# EAGLE design HS(MASTER)V3 (EAGLE 8.3.0)
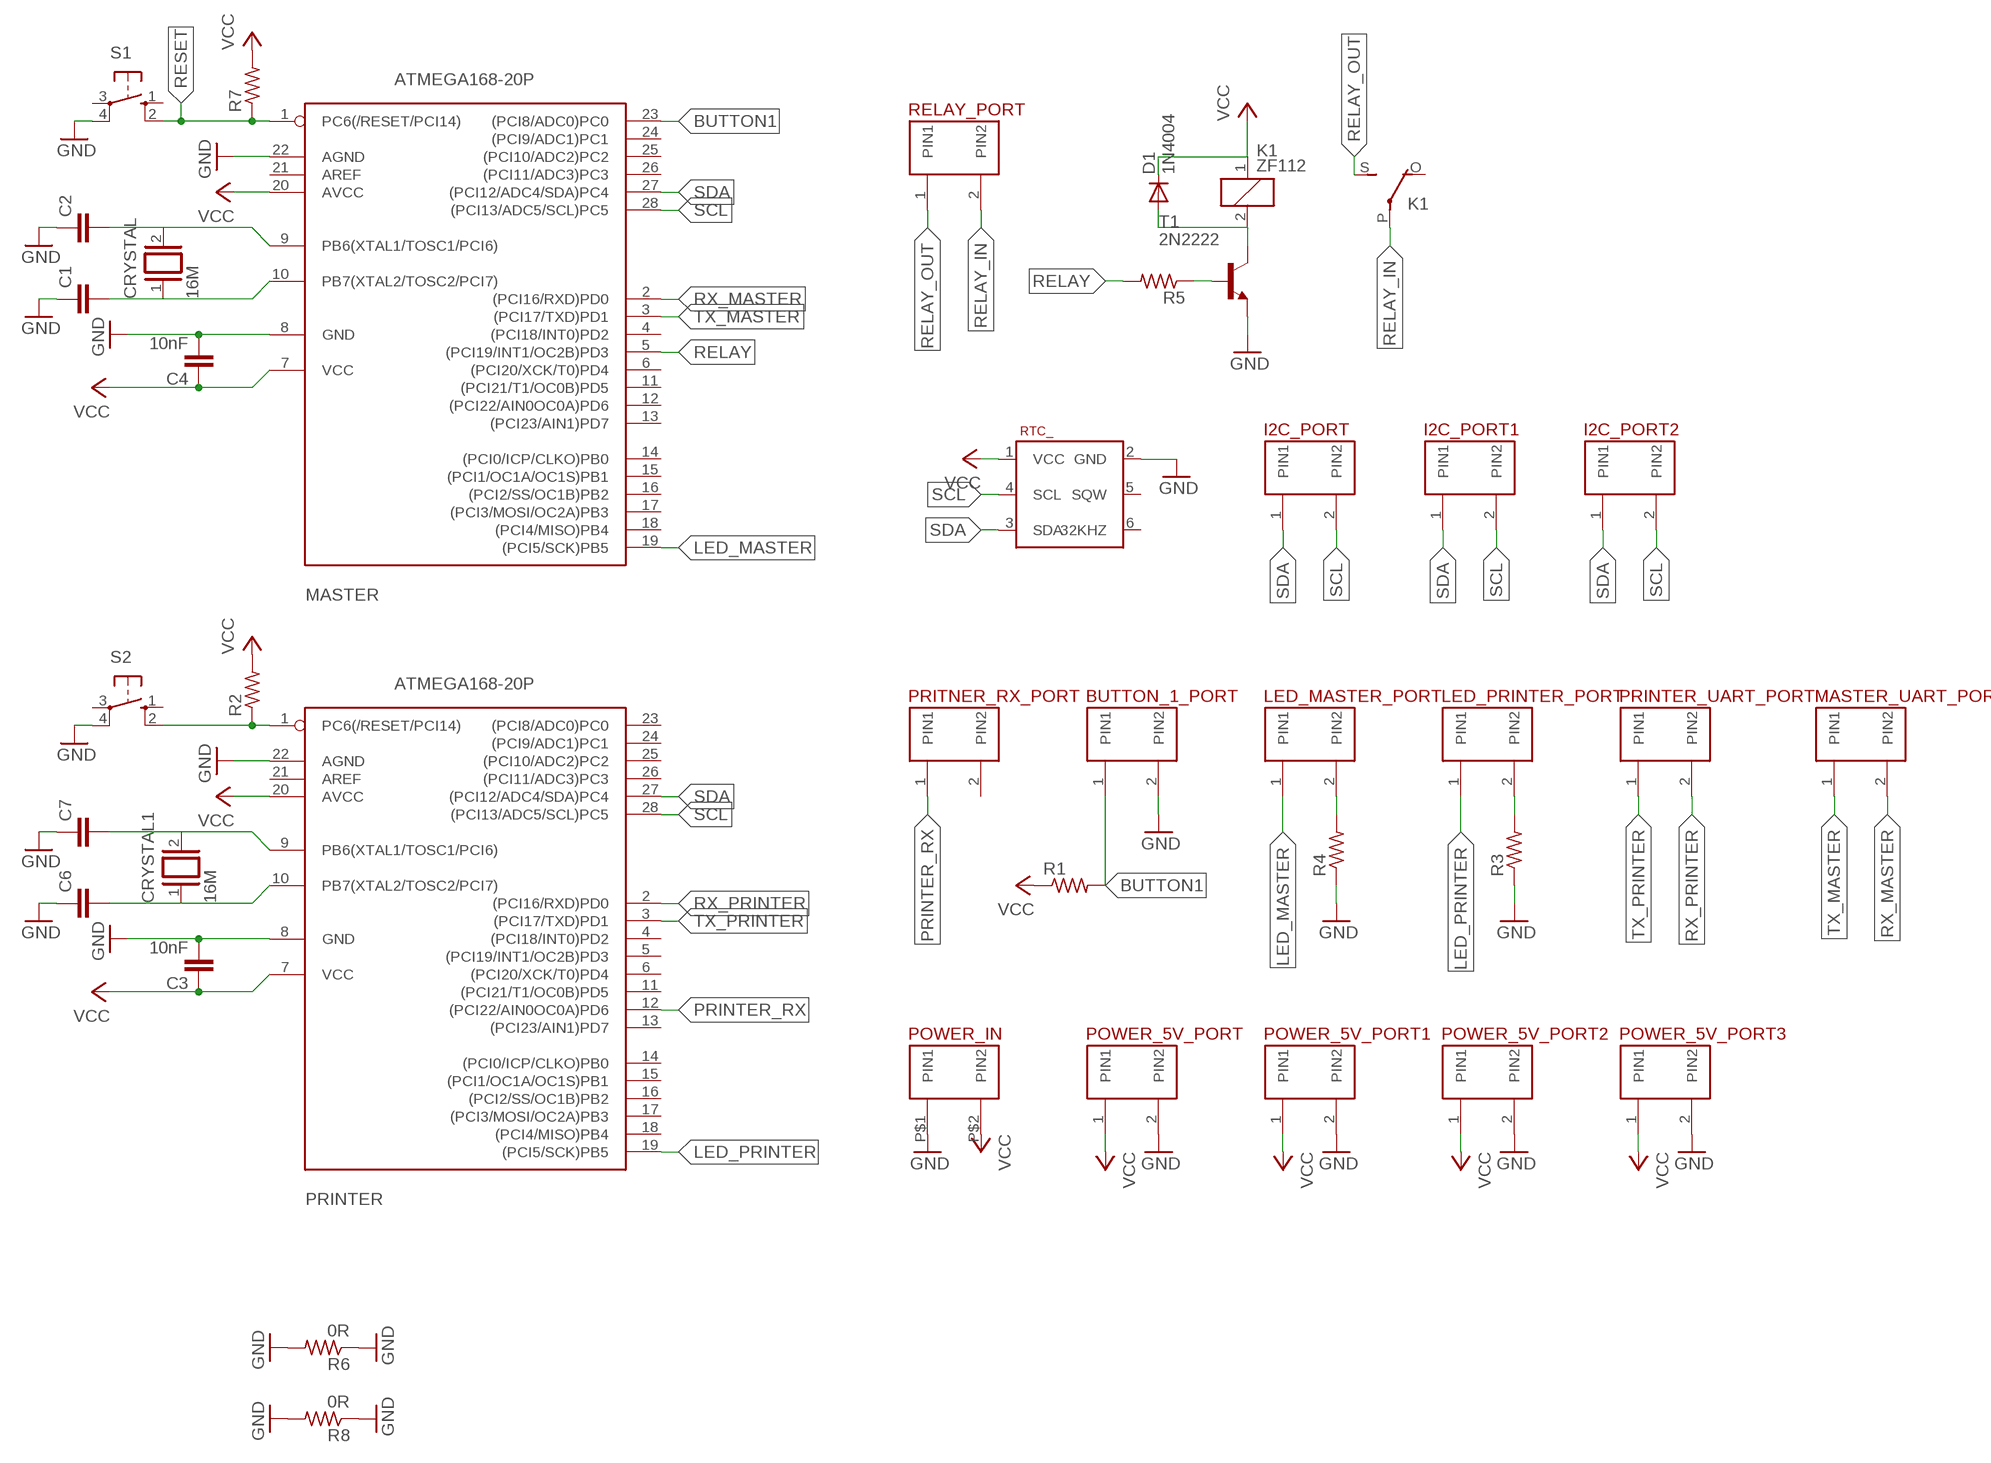
[diagram p0: schematic, sheet 1]

## Parts
BUTTON_1_PORT  7325  [2.54MM]
C1  C-EU025-024X044  [C025-024X044]
C2  C-EU025-024X044  [C025-024X044]
C3  10nF  C5/2.5  [C5B2.5]
C4  10nF  C5/2.5  [C5B2.5]
C6  C-EU025-024X044  [C025-024X044]
C7  C-EU025-024X044  [C025-024X044]
CRYSTAL  16M  XTAL/S  [QS]
CRYSTAL1  16M  XTAL/S  [QS]
D1  1N4004  [DO41-10]
I2C_PORT  7325  [2.54MM]
I2C_PORT1  7325  [2.54MM]
I2C_PORT2  7325  [2.54MM]
K1  ZF112  [ZF112]
LED_MASTER_PORT  7325  [2.54MM]
LED_PRINTER_PORT  7325  [2.54MM]
MASTER  ATMEGA168-20P  [DIL28-3]
MASTER_UART_PORT  7325  [2.54MM]
POWER_5V_PORT  7325  [2.54MM]
POWER_5V_PORT1  7325  [2.54MM]
POWER_5V_PORT2  7325  [2.54MM]
POWER_5V_PORT3  7325  [2.54MM]
POWER_IN  4396  [4MM]
PRINTER  ATMEGA168-20P  [DIL28-3]
PRINTER_UART_PORT  7325  [2.54MM]
PRITNER_RX_PORT  7325  [2.54MM]
R1  R-US_0207/10  [0207/10]
R2  R-US_0207/10  [0207/10]
R3  R-US_0207/10  [0207/10]
R4  R-US_0207/10  [0207/10]
R5  R-US_0207/10  [0207/10]
R6  0R  R-US_0207/10  [0207/10]
R7  R-US_0207/10  [0207/10]
R8  0R  R-US_0207/10  [0207/10]
RELAY_PORT  7325  [2.54MM]
RTC_  RTC_DS3231_6_PIN  [RTC_DS3231_6_PIN]
S1  10-XX  [B3F-10XX]
S2  10-XX  [B3F-10XX]
T1  2N2222  [TO92-EBC-OVAL]

## Nets
BUTTON1: BUTTON_1_PORT.1(PIN1) MASTER.23((PCI8/ADC0)PC0) R1.2
GND: BUTTON_1_PORT.2(PIN2) C1.1 C2.1 C3.2 C4.2 C6.1 C7.1 MASTER.8(GND) MASTER.22(AGND) POWER_5V_PORT1.2(PIN2) POWER_5V_PORT2.2(PIN2) POWER_5V_PORT3.2(PIN2) POWER_5V_PORT.2(PIN2) POWER_IN.P$1(PIN1) PRINTER.8(GND) PRINTER.22(AGND) R3.1 R4.1 R6.1 R6.2 R8.1 R8.2 RTC_.2(GND) S1.4(P1) S2.4(P1) T1.E
LED_MASTER: LED_MASTER_PORT.1(PIN1) MASTER.19((PCI5/SCK)PB5)
LED_PRINTER: LED_PRINTER_PORT.1(PIN1) PRINTER.19((PCI5/SCK)PB5)
N$1: C2.2 CRYSTAL.2 MASTER.9(PB6(XTAL1/TOSC1/PCI6))
N$2: C1.2 CRYSTAL.1 MASTER.10(PB7(XTAL2/TOSC2/PCI7))
N$3: D1.A K1.2 T1.C
N$5: LED_MASTER_PORT.2(PIN2) R4.2
N$6: C7.2 CRYSTAL1.2 PRINTER.9(PB6(XTAL1/TOSC1/PCI6))
N$7: C6.2 CRYSTAL1.1 PRINTER.10(PB7(XTAL2/TOSC2/PCI7))
N$8: PRINTER.1(PC6(/RESET/PCI14)) R2.1 S2.2(S1)
N$9: LED_PRINTER_PORT.2(PIN2) R3.2
N$11: R5.1 T1.B
PRINTER_RX: PRINTER.12((PCI22/AIN0OC0A)PD6) PRITNER_RX_PORT.1(PIN1)
RELAY: MASTER.5((PCI19/INT1/OC2B)PD3) R5.2
RELAY_IN: K1.P(2:P) RELAY_PORT.2(PIN2)
RELAY_OUT: K1.S(2:S) RELAY_PORT.1(PIN1)
RESET: MASTER.1(PC6(/RESET/PCI14)) R7.1 S1.2(S1)
RX_MASTER: MASTER.2((PCI16/RXD)PD0) MASTER_UART_PORT.2(PIN2)
RX_PRINTER: PRINTER.2((PCI16/RXD)PD0) PRINTER_UART_PORT.2(PIN2)
SCL: I2C_PORT1.2(PIN2) I2C_PORT2.2(PIN2) I2C_PORT.2(PIN2) MASTER.28((PCI13/ADC5/SCL)PC5) PRINTER.28((PCI13/ADC5/SCL)PC5) RTC_.4(SCL)
SDA: I2C_PORT1.1(PIN1) I2C_PORT2.1(PIN1) I2C_PORT.1(PIN1) MASTER.27((PCI12/ADC4/SDA)PC4) PRINTER.27((PCI12/ADC4/SDA)PC4) RTC_.3(SDA)
TX_MASTER: MASTER.3((PCI17/TXD)PD1) MASTER_UART_PORT.1(PIN1)
TX_PRINTER: PRINTER.3((PCI17/TXD)PD1) PRINTER_UART_PORT.1(PIN1)
VCC: C3.1 C4.1 D1.C K1.1 MASTER.7(VCC) MASTER.20(AVCC) POWER_5V_PORT1.1(PIN1) POWER_5V_PORT2.1(PIN1) POWER_5V_PORT3.1(PIN1) POWER_5V_PORT.1(PIN1) POWER_IN.P$2(PIN2) PRINTER.7(VCC) PRINTER.20(AVCC) R1.1 R2.2 R7.2 RTC_.1(VCC)
Unconnected: K1.O(2:O) MASTER.4((PCI18/INT0)PD2) MASTER.6((PCI20/XCK/T0)PD4) MASTER.11((PCI21/T1/OC0B)PD5) MASTER.12((PCI22/AIN0OC0A)PD6) MASTER.13((PCI23/AIN1)PD7) MASTER.14((PCI0/ICP/CLKO)PB0) MASTER.15((PCI1/OC1A/OC1S)PB1) MASTER.16((PCI2/SS/OC1B)PB2) MASTER.17((PCI3/MOSI/OC2A)PB3) MASTER.18((PCI4/MISO)PB4) MASTER.21(AREF) MASTER.24((PCI9/ADC1)PC1) MASTER.25((PCI10/ADC2)PC2) MASTER.26((PCI11/ADC3)PC3) PRINTER.4((PCI18/INT0)PD2) PRINTER.5((PCI19/INT1/OC2B)PD3) PRINTER.6((PCI20/XCK/T0)PD4) PRINTER.11((PCI21/T1/OC0B)PD5) PRINTER.13((PCI23/AIN1)PD7) PRINTER.14((PCI0/ICP/CLKO)PB0) PRINTER.15((PCI1/OC1A/OC1S)PB1) PRINTER.16((PCI2/SS/OC1B)PB2) PRINTER.17((PCI3/MOSI/OC2A)PB3) PRINTER.18((PCI4/MISO)PB4) PRINTER.21(AREF) PRINTER.23((PCI8/ADC0)PC0) PRINTER.24((PCI9/ADC1)PC1) PRINTER.25((PCI10/ADC2)PC2) PRINTER.26((PCI11/ADC3)PC3) PRITNER_RX_PORT.2(PIN2) RTC_.5(SQW) RTC_.6(32KHZ) S1.1(S) S1.3(P) S2.1(S) S2.3(P)

## Library data of the parts
BUTTON_1_PORT I2C_PORT I2C_PORT1 I2C_PORT2 LED_MASTER_PORT LED_PRINTER_PORT MASTER_UART_PORT POWER_5V_PORT POWER_5V_PORT1-POWER_5V_PORT3 PRINTER_UART_PORT PRITNER_RX_PORT RELAY_PORT = pin header:7325
C1 C2 C6 C7 = resistor:C-EU: CAPACITOR, European symbol
C3 C4 = capacitor-wima:C: CAPACITOR naming: grid - package width
CRYSTAL CRYSTAL1 = special:XTAL/S: CRYSTAL
D1 = adafruit:1N4004: DIODE General purpose 1N400x type rectifier (With bigger pads) http://www.ladyada.net/library/pcb/eaglelibrary.html
K1 = relay:ZF112: RELAY 1 x switch; OC_FARNELL: unknown; OC_NEWARK: unknown
MASTER PRINTER = adafruit:ATMEGA168*P: MICROCONTROLLER 16 kBytes FLASH 1 kBytes SRAM 512 Bytes EEPROM USART 8-channel 10 bit ADC
POWER_IN = pin header:4396
R1-R8 = adafruit:R-US_: RESISTOR, American symbol
RTC_ = sonchai:RTC_DS3231_6_PIN
S1 S2 = switch-omron:10-XX: OMRON SWITCH; MPN: B3F-1000; OC_FARNELL: 176432; OC_NEWARK: 36M3542
T1 = adafruit:2N2222: NPN TRANSISTOR Big oval pads

## Net classes
0 default: width 0.15 mm, drill 0.3 mm, clearance 0.15 mm

## Board
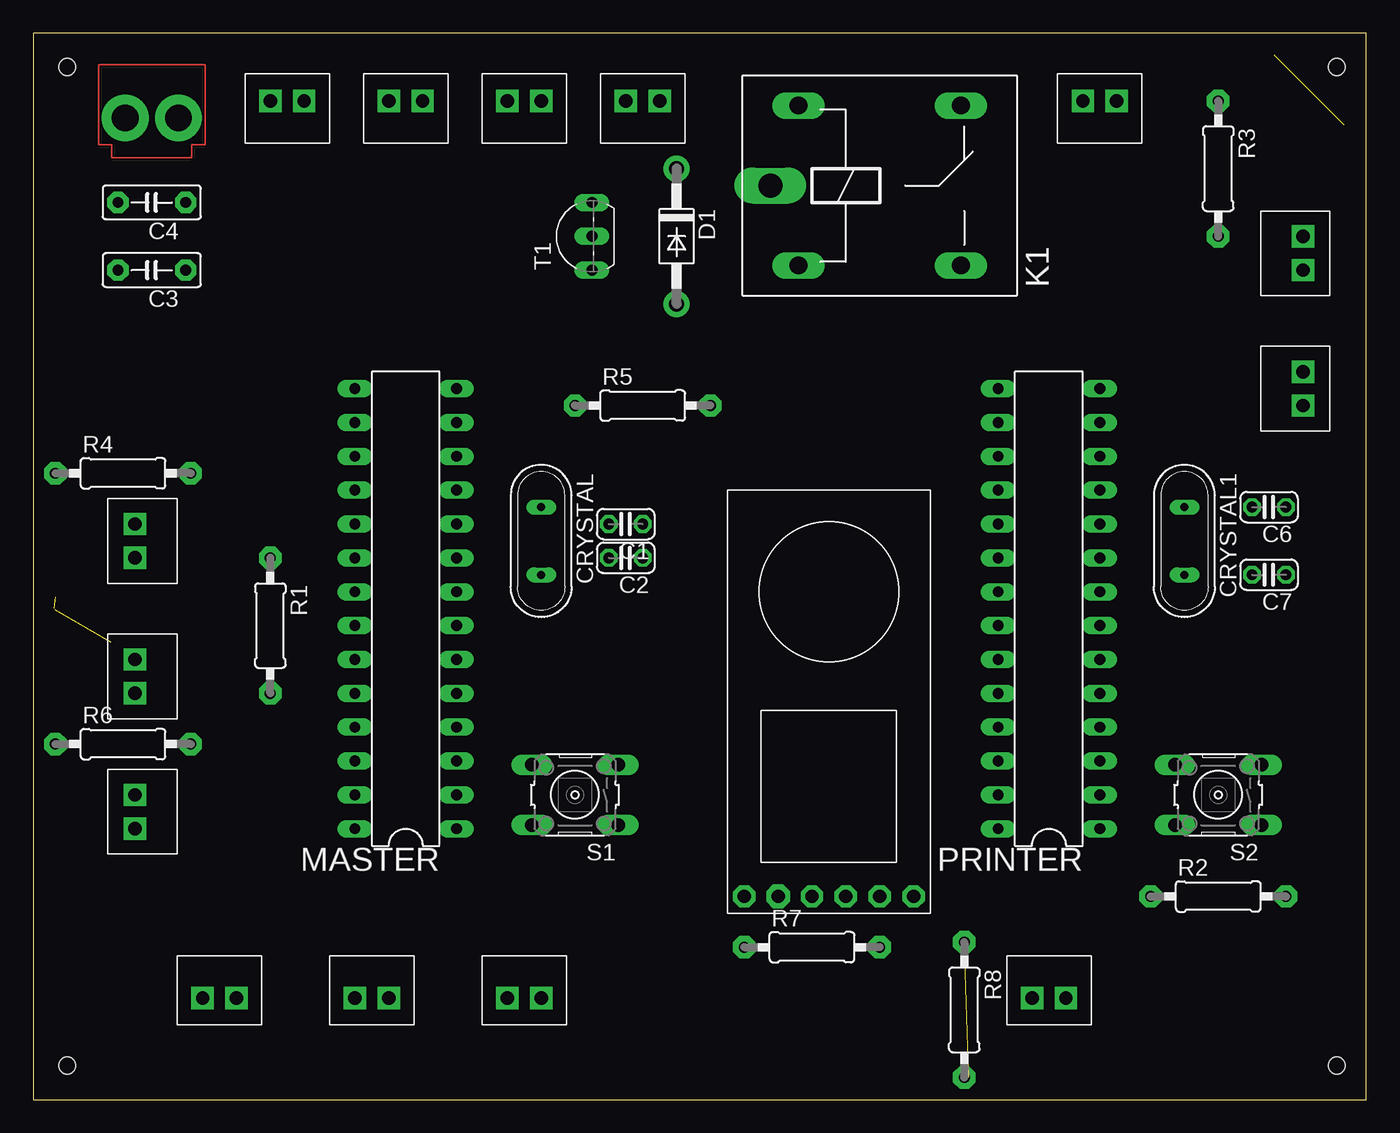
[diagram p1: board, top side]
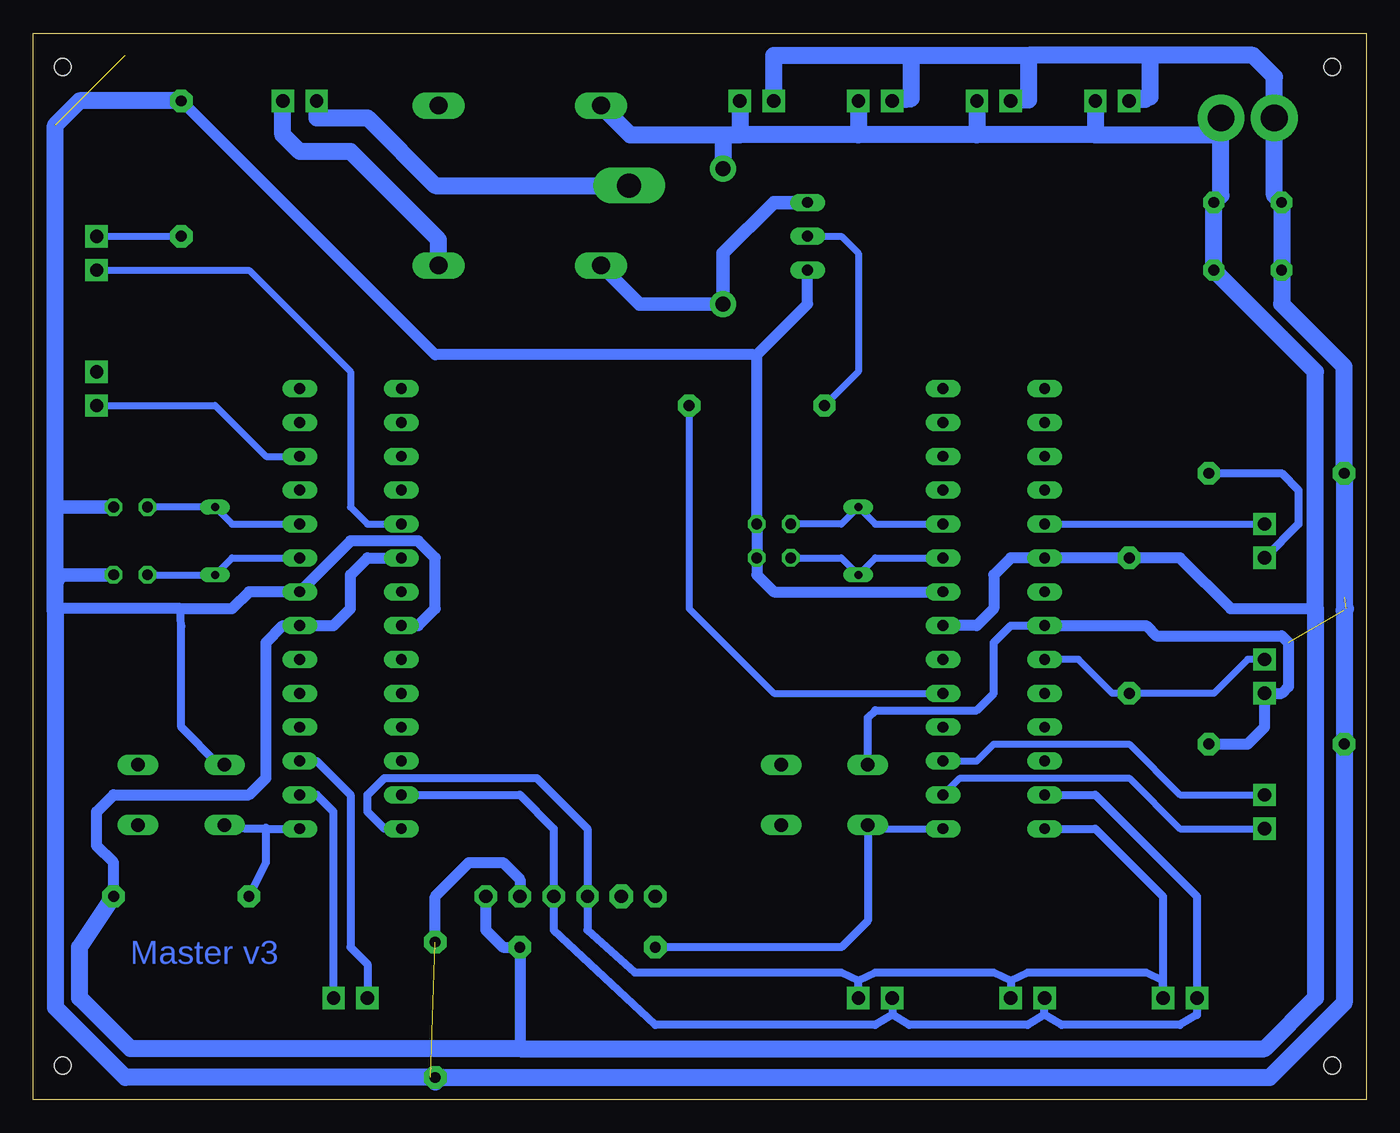
[diagram p2: board, bottom side, seen from below]

Size 100 x 80 mm. Coordinates in mm from the lower left corner, seen from the top.
Outline: 0,0 100,0 100,80 0,80 0,0
Copper layers (1*16): Top 0.035mm / dielectric 1.5mm / Bottom 0.035mm
Design rules "default": minimum track width 6mil, minimum drill 0.35mm, track to track 6mil, track to pad 6mil, pad to pad 6mil, via to via 6mil, smd to smd 6mil, copper to edge 40mil, drill to drill 6mil, minimum pad ring 10mil, minimum via ring 8mil, stop-mask expansion 4mil, vias tented up to drill 0mil, thermal gap 10mil
Holes 1.27 mm at 2.54,77.47 2.54,2.54 97.79,2.54 97.79,77.47

### Footprints (pad centres in the part's own frame; a part is rotated, then mirrored left to right if it is on the bottom)
2.54MM = drill 1 pad 1.676 square: 1 -1.27,0; 2 1.27,0
C025-024X044 = drill 0.813 octagon: 1 -1.27,0; 2 1.27,0
C5B2.5 = drill 0.813 pad 1.6 octagon: 1 -2.54,0; 2 2.54,0
QS = drill 0.61 long: 1 -2.54,0; 2 2.54,0
DO41-10 = drill 1.118 pad 1.93: A 5.08,0; C -5.08,0
ZF112 = drill 1.321 long: 1 -6.096,5.994; 2 -6.096,-5.994; O 6.096,5.994; S 6.096,-5.994 | drill 1.803 long: P -8.204,0
DIL28-3 = drill 0.813 long: 1 -16.51,-3.81; 2 -13.97,-3.81; 3 -11.43,-3.81; 4 -8.89,-3.81; 5 -6.35,-3.81; 6 -3.81,-3.81; 7 -1.27,-3.81; 8 1.27,-3.81; 9 3.81,-3.81; 10 6.35,-3.81; 11 8.89,-3.81; 12 11.43,-3.81; 13 13.97,-3.81; 14 16.51,-3.81; 15 16.51,3.81; 16 13.97,3.81; 17 11.43,3.81; 18 8.89,3.81; 19 6.35,3.81; 20 3.81,3.81; 21 1.27,3.81; 22 -1.27,3.81; 23 -3.81,3.81; 24 -6.35,3.81; 25 -8.89,3.81; 26 -11.43,3.81; 27 -13.97,3.81; 28 -16.51,3.81
4MM = drill 2 pad 3.5: P$1 -2,0; P$2 2,0
0207/10 = drill 0.813 pad 1.676 octagon: 1 -5.08,0; 2 5.08,0
RTC_DS3231_6_PIN = drill 1 pad 1.676 octagon: 1 1.27,-1.27; 2 3.81,-1.27; 3 6.35,-1.27; 4 8.89,-1.27; 6 13.97,-1.27 | drill 1 pad 1.778 octagon: 5 11.43,-1.27
B3F-10XX = drill 1.016 long: 1 -3.251,2.261; 2 3.251,2.261; 3 -3.251,-2.261; 4 3.251,-2.261
TO92-EBC-OVAL = drill 0.813 long: B 0,-1.27; C 2.54,-1.27; E -2.54,-1.27

### Placement (x,y rotation side)
BUTTON_1_PORT  7.62,31.75 270 top
C1  44.45,43.18 180 top
C2  44.45,40.64 180 top
C3  8.89,62.23 180 top
C4  8.89,67.31 180 top
C6  92.71,44.45 180 top
C7  92.71,39.37 180 top
CRYSTAL  38.1,41.91 270 top
CRYSTAL1  86.36,41.91 270 top
D1  48.26,64.77 270 top
I2C_PORT  13.97,7.62 0 top
I2C_PORT1  25.4,7.62 0 top
I2C_PORT2  36.83,7.62 0 top
K1  63.5,68.58 0 top
LED_MASTER_PORT  7.62,41.91 270 top
LED_PRINTER_PORT  95.25,63.5 90 top
MASTER  27.94,36.83 90 top
MASTER_UART_PORT  7.62,21.59 270 top
POWER_5V_PORT  19.05,74.93 180 top
POWER_5V_PORT1  27.94,74.93 180 top
POWER_5V_PORT2  36.83,74.93 180 top
POWER_5V_PORT3  45.72,74.93 180 top
POWER_IN  8.89,73.66 0 top
PRINTER  76.2,36.83 90 top
PRINTER_UART_PORT  76.2,7.62 0 top
PRITNER_RX_PORT  95.25,53.34 90 top
R1  17.78,35.56 270 top
R2  88.9,15.24 0 top
R3  88.9,69.85 270 top
R4  6.73,46.99 0 top
R5  45.72,52.07 0 top
R6  6.73,26.67 0 top
R7  58.42,11.43 0 top
R8  69.85,6.73 270 top
RELAY_PORT  80.01,74.93 180 top
RTC_  67.31,13.97 180 top
S1  40.64,22.86 180 top
S2  88.9,22.86 180 top
T1  40.64,64.77 90 top

### Tracks (layer width: path | path; a pad name or v marks a point on that pad's centre or on a via)
BUTTON1
  Bottom 0.508: BUTTON_1_PORT.1 8.89,33.02 11.43,30.48 R1.2 19.05,30.48 21.59,33.02 MASTER.23
GND  (4 unrouted)
  Bottom 0.508: MASTER.8 31.75,37.9 31.75,37.73
  Bottom 0.61: S2.4 86.08,25.12 88.9,27.94 88.9,35.5 88.96,36.83 | S1.4 37.39,28.65 36.83,29.21 29.21,29.21 27.94,30.48 27.94,34.29 26.67,35.56 MASTER.22
  Bottom 0.813: R3.1 69.85,55.88 45.96,55.88 | 45.96,55.88 45.72,55.88 41.91,59.69 T1.E | 45.96,55.88 45.72,55.64 C1.1 C2.1 45.72,39.37 44.45,38.1 31.95,38.1 31.75,37.9 | MASTER.22 16.51,35.56 15.75,34.8 6.35,34.8 5.84,34.29 5.84,30.99 6.35,30.48 BUTTON_1_PORT.2 7.62,27.94 8.89,26.67 R6.2 | 98.35,36.59 98.1,36.83 88.96,36.83 85.09,36.83 83.82,38.1 PRINTER.8 76.2,41.91 71.12,41.91 69.85,40.64 69.85,36.83 71.12,35.56 PRINTER.22 | R8.1 69.85,15.24 67.31,17.78 64.77,17.78 63.5,16.51 RTC_.2
  Bottom 1.016: C7.1 97.79,39.37 98.35,38.81 | C6.1 98.12,44.45 98.35,44.22 | 1.65,37.72 1.65,37.82
  Bottom 1.27: 16.21,78.35 25.32,78.35 | 34.12,78.35 25.32,78.35 | 16.6,75.02 POWER_5V_PORT.2 16.21,75.23 16.21,78.35 | POWER_5V_PORT1.2 25.32,75.02 25.32,78.35 | POWER_5V_PORT2.2 34.12,75.1 34.12,78.35 | POWER_5V_PORT3.2 44.45,78.35 34.12,78.35 | 16.21,78.35 8.5,78.35 6.89,76.74 POWER_IN.P$1 6.89,67.85 C4.2 C3.2 6.35,59.69 1.65,54.99 1.65,46.96 | 70.18,1.65 7.24,1.65 1.65,7.24 1.65,26.5 | 70.18,1.65 93.09,1.65 98.35,6.91 98.35,36.59 98.35,38.81 98.35,44.22 98.35,73.1 96.52,74.93 R3.1 | 1.65,36.72 1.65,26.5 | 1.65,46.96 1.65,36.72 | R6.1 1.48,26.67 1.65,26.5 | 1.54,36.83 1.65,36.72 | R4.1 1.62,46.99 1.65,46.96 | R8.2 69.85,1.32 70.18,1.65
LED_MASTER
  Bottom 0.508: MASTER.19 LED_MASTER_PORT.1
LED_PRINTER
  Bottom 0.508: LED_PRINTER_PORT.1 83.82,62.23 76.2,54.61 76.2,44.45 74.93,43.18 PRINTER.19
N$1
  Bottom 0.508: C2.2 39.37,40.64 CRYSTAL.2 36.83,40.64 MASTER.9
N$2
  Bottom 0.508: C1.2 39.37,43.18 CRYSTAL.1 36.83,43.18 MASTER.10
N$3
  Bottom 1.016: K1.2 54.51,59.69 D1.A 48.26,63.5 44.45,67.31 T1.C
N$5
  Bottom 0.61: R4.2 6.35,46.99 5.08,45.72 5.08,43.18 LED_MASTER_PORT.2
N$6
  Bottom 0.508: C7.2 CRYSTAL1.2 85.09,40.64 PRINTER.9
N$7
  Bottom 0.508: PRINTER.10 85.09,43.18 CRYSTAL1.1 C6.2
N$8
  Bottom 0.61: 82.48,20.32 PRINTER.1 | 82.48,20.32 84.1,20.32 S2.2 | R2.1 82.55,17.78 82.55,20.39 82.48,20.32
N$9
  Bottom 0.508: LED_PRINTER_PORT.2 R3.2
N$11
  Bottom 0.508: T1.B 39.37,64.77 38.1,63.5 38.1,54.61 R5.1
PRINTER_RX
  Bottom 0.508: PRITNER_RX_PORT.1 86.36,52.07 82.55,48.26 PRINTER.12
RELAY
  Bottom 0.508: R5.2 50.8,36.83 44.45,30.48 MASTER.5
RELAY_IN
  Bottom 1.27: RELAY_PORT.2 78.74,73.66 74.93,73.66 69.85,68.58 K1.P
RELAY_OUT
  Bottom 1.27: K1.S 69.6,64.52 76.2,71.12 80.01,71.12 81.28,72.39 RELAY_PORT.1
RESET
  Bottom 0.508: S1.2 37.11,20.32 MASTER.1
  Bottom 0.61: S1.2 37.39,13.41 39.37,11.43 R7.1
RX_MASTER
  Bottom 0.508: MASTER.2 30.48,24.13 17.78,24.13 13.97,20.32 MASTER_UART_PORT.2
RX_PRINTER
  Bottom 0.61: PRINTER.2 78.74,22.86 77.47,21.59 PRINTER_UART_PORT.2
SCL
  Bottom 0.61: 26.67,8.89 25.4,9.53 16.51,9.53 15.24,8.89 I2C_PORT.2 15.24,15.24 20.32,20.32 MASTER.28 | 26.67,8.89 I2C_PORT1.2 | 26.67,8.89 27.94,9.53 36.83,9.53 38.1,8.89 | I2C_PORT2.2 38.1,8.89 | 38.1,8.89 39.37,9.53 54.86,9.53 58.42,12.7 RTC_.4 58.42,20.32 62.23,24.13 73.66,24.13 74.93,22.86 74.93,21.59 73.66,20.32 PRINTER.28
SDA
  Bottom 0.61: 24.13,6.35 22.86,5.59 13.97,5.59 12.7,6.35 I2C_PORT.1 12.7,15.24 20.32,22.86 MASTER.27 | 24.13,6.35 I2C_PORT1.1 | 24.13,6.35 25.4,5.59 34.29,5.59 35.56,6.35 | I2C_PORT2.1 35.56,6.35 | 35.56,6.35 36.83,5.59 53.34,5.59 60.96,12.7 RTC_.3 60.96,20.32 63.5,22.86 PRINTER.27
TX_MASTER
  Bottom 0.508: MASTER.3 29.21,25.4 27.94,26.67 17.78,26.67 13.97,22.86 MASTER_UART_PORT.1
TX_PRINTER
  Bottom 0.61: PRINTER.3 78.74,25.4 76.2,22.86 76.2,11.43 74.93,10.16 PRINTER_UART_PORT.1
VCC
  Bottom 0.813: R2.2 93.98,17.78 95.25,19.05 95.25,21.59 93.98,22.86 83.82,22.86 82.55,24.13 82.55,34.29 81.28,35.56 PRINTER.7 77.47,35.56 76.2,36.83 76.2,39.37 74.93,40.64 PRINTER.20 | 3.81,36.83 10.16,36.83 13.97,40.64 R1.1 MASTER.20 26.67,40.64 27.94,39.37 27.94,36.83 29.21,35.56 MASTER.7 | RTC_.1 66.04,12.7 64.77,11.43 R7.2 63.5,3.81
  Bottom 1.27: C3.1 C4.1 10.89,67.85 POWER_IN.P$2 10.89,72.39 20.32,72.39 | 38.1,72.39 46.99,72.39 | 29.21,72.39 38.1,72.39 | 20.32,72.39 29.21,72.39 | 48.26,72.39 46.99,72.39 | 48.26,72.39 D1.C | POWER_5V_PORT3.1 46.99,72.39 | POWER_5V_PORT2.1 38.1,72.39 | POWER_5V_PORT1.1 29.21,72.39 | POWER_5V_PORT.1 20.32,72.39 | K1.1 55.22,72.39 48.26,72.39 | R2.2 96.52,11.43 96.52,7.62 92.71,3.81 63.5,3.81 7.62,3.81 3.81,7.62 3.81,36.83 3.81,54.61 C3.1 | C3.1 9.79,60.59

### Text on the board
Bottom: Master v3